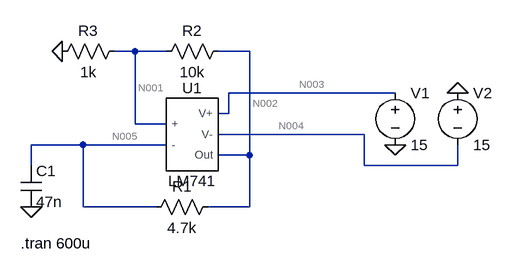
[diagram p0: schematic 4-8.asc]
4-8.asc, the LTspice schematic file:
Version 4.1
SHEET 1 880 680
WIRE 112 16 80 16
WIRE 160 16 112 16
WIRE 288 16 240 16
WIRE 512 80 256 80
WIRE 256 112 256 80
WIRE 256 112 240 112
WIRE 112 128 112 16
WIRE 160 128 112 128
WIRE 464 144 240 144
WIRE 32 160 -48 160
WIRE 160 160 32 160
WIRE 288 176 288 16
WIRE 288 176 240 176
WIRE -48 192 -48 160
WIRE 464 192 464 144
WIRE 608 192 608 160
WIRE 608 192 464 192
WIRE 32 256 32 160
WIRE 144 256 32 256
WIRE 288 256 288 176
WIRE 288 256 224 256
FLAG 512 160 0
FLAG 608 80 0
FLAG -48 256 0
FLAG 0 16 0
SYMBOL LM741 192 144 R0
SYMATTR InstName U1
SYMBOL voltage 512 64 R0
WINDOW 123 0 0 Left 0
WINDOW 39 0 0 Left 0
SYMATTR InstName V1
SYMATTR Value 15
SYMBOL voltage 608 64 R0
WINDOW 123 0 0 Left 0
WINDOW 39 0 0 Left 0
SYMATTR InstName V2
SYMATTR Value 15
SYMBOL cap -64 192 R0
SYMATTR InstName C1
SYMATTR Value 47n
SYMBOL res 240 240 R90
WINDOW 0 0 56 VBottom 2
WINDOW 3 32 56 VTop 2
SYMATTR InstName R1
SYMATTR Value 4.7k
SYMBOL res 256 0 R90
WINDOW 0 0 56 VBottom 2
WINDOW 3 32 56 VTop 2
SYMATTR InstName R2
SYMATTR Value 10k
SYMBOL res 96 0 R90
WINDOW 0 0 56 VBottom 2
WINDOW 3 32 56 VTop 2
SYMATTR InstName R3
SYMATTR Value 1k
TEXT -64 312 Left 2 !.tran 600u

The netlist it stands for:
* 4-8.asc
X§U1 N001 N005 N003 N004 N002 LM741  ; pins + - V+ V- Out
V1 N003 0 15
V2 0 N004 15
C1 N005 0 47n
R1 N002 N005 4.7k
R2 N002 N001 10k
R3 N001 0 1k
.tran 600u
.lib lm741.lib
.backanno
.end

* Results of the author's LTspice run, read from the files saved beside the schematic
* Operating Point, zero values left out:
*   V(n001) = 90.02 µV
*   V(n002) = 1.569 mV
*   V(n003) = 15 V
*   V(n004) = -15 V
*   V(n005) = 1.09 mV
*   I(R1) = 101.9 nA
*   I(R2) = 147.9 nA
*   I(R3) = 90.02 nA
*   I(V1) = -1.701 mA
*   I(V2) = -1.701 mA
*   Ix(u1:1) = 57.86 nA
*   Ix(u1:2) = 101.9 nA
*   Ix(u1:28) = -249.7 nA
*   Ix(u1:50) = -1.701 mA
*   Ix(u1:99) = 1.701 mA
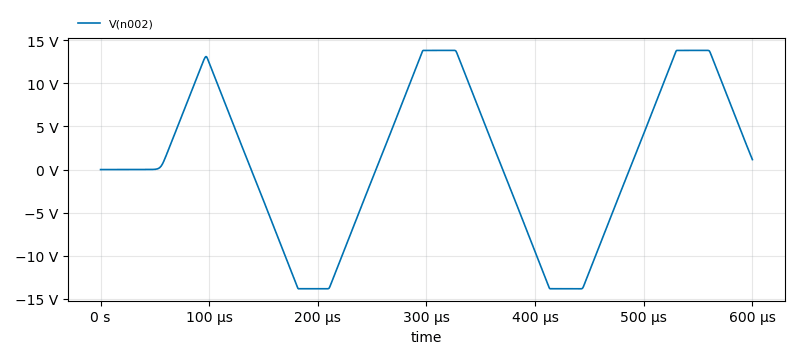
[diagram p1: Transient Analysis of 4-8.asc, plotted from the saved traces]
* Transient Analysis, 1 run:
*   V(n002): min -13.83 V, max 13.83 V, average 967 mV, rms 9.102 V, last 1.157 V